# Altium schematic sheet BMS schematic.schdoc
size 310 x 208 mm
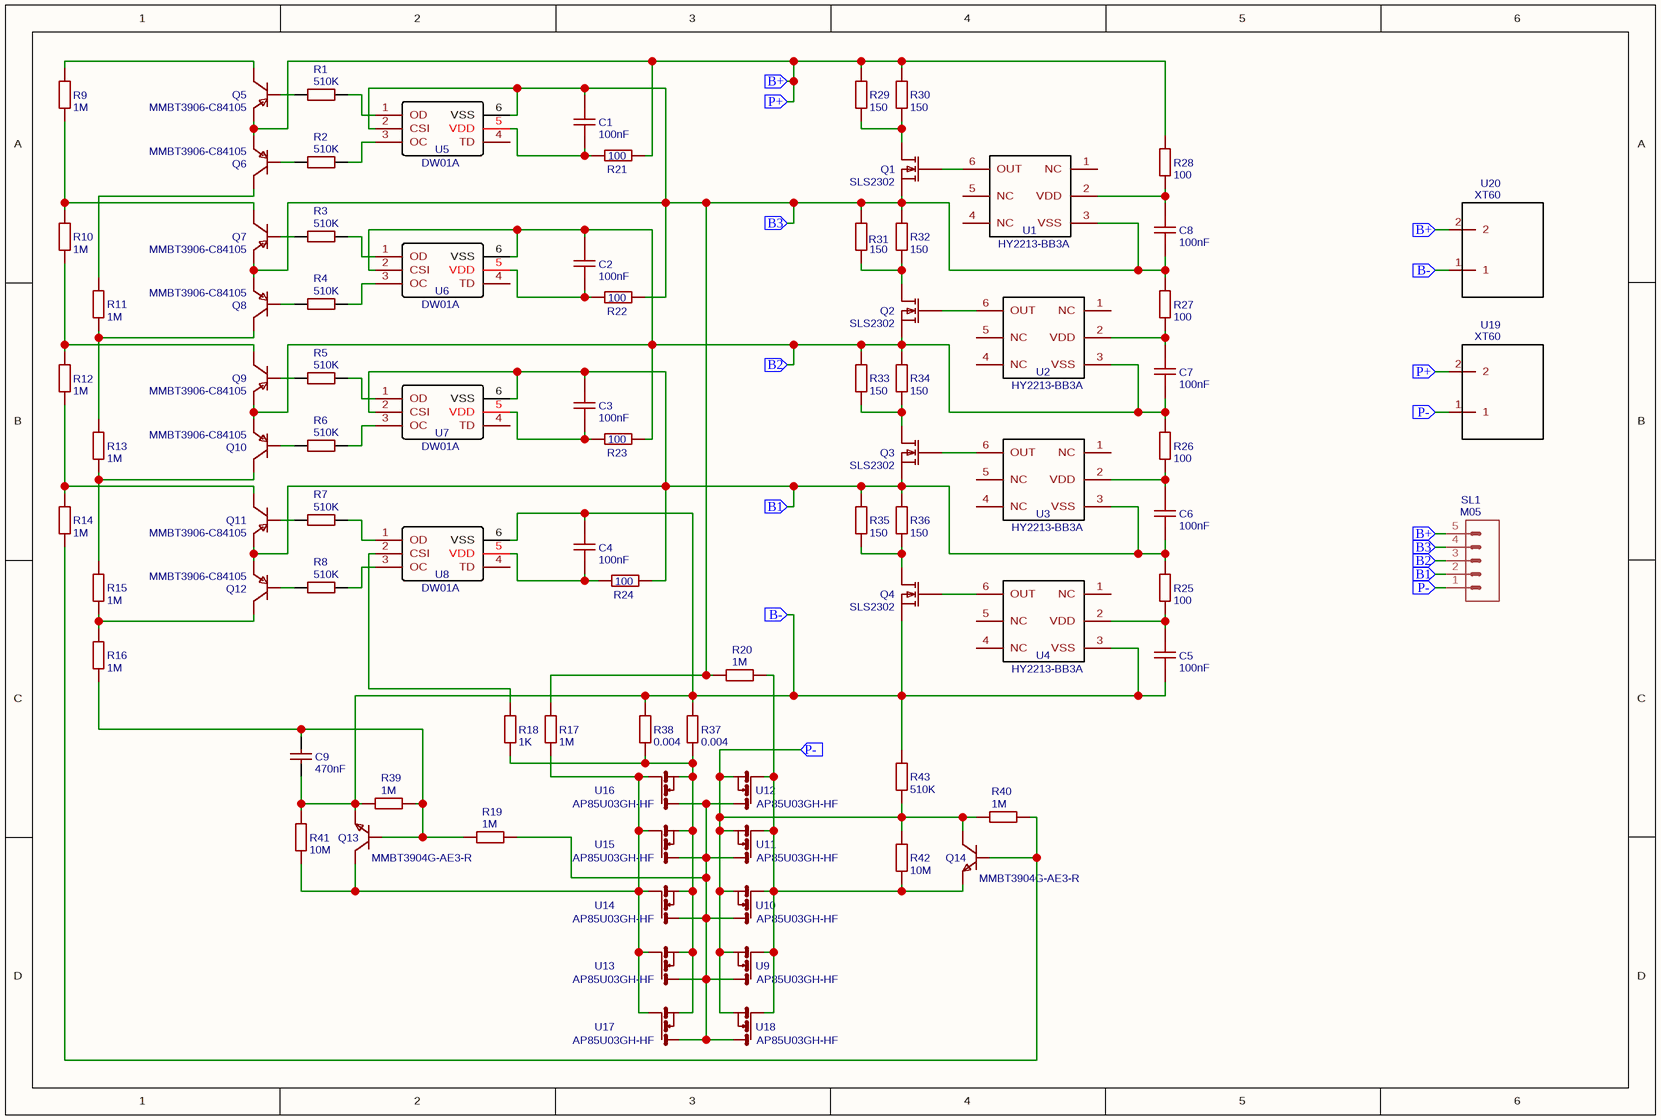
[diagram p0: BMS schematic.schdoc]

## Parts
C1  100nF  [C0805]
C2  100nF  [C0805]
C3  100nF  [C0805]
C4  100nF  [C0805]
C5  100nF  [C0805]
C6  100nF  [C0805]
C7  100nF  [C0805]
C8  100nF  [C0805]
C9  470nF  [C0805]
Q1  SLS2302  [SOT-23-3]
Q2  SLS2302  [SOT-23-3]
Q3  SLS2302  [SOT-23-3]
Q4  SLS2302  [SOT-23-3]
Q5  MMBT3906-C84105  [SOT-23-3_L2.9-W1.3-P1.90-LS2.4-BR]
Q6  MMBT3906-C84105  [SOT-23-3_L2.9-W1.3-P1.90-LS2.4-BR]
Q7  MMBT3906-C84105  [SOT-23-3_L2.9-W1.3-P1.90-LS2.4-BR]
Q8  MMBT3906-C84105  [SOT-23-3_L2.9-W1.3-P1.90-LS2.4-BR]
Q9  MMBT3906-C84105  [SOT-23-3_L2.9-W1.3-P1.90-LS2.4-BR]
Q10  MMBT3906-C84105  [SOT-23-3_L2.9-W1.3-P1.90-LS2.4-BR]
Q11  MMBT3906-C84105  [SOT-23-3_L2.9-W1.3-P1.90-LS2.4-BR]
Q12  MMBT3906-C84105  [SOT-23-3_L2.9-W1.3-P1.90-LS2.4-BR]
Q13  MMBT3904G-AE3-R  [SOT-23-3_L2.9-W1.6-P1.90-LS2.8-TR-CW]
Q14  MMBT3904G-AE3-R  [SOT-23-3_L2.9-W1.6-P1.90-LS2.8-TR-CW]
R1  510K  [R0805]
R2  510K  [R0805]
R3  510K  [R0805]
R4  510K  [R0805]
R5  510K  [R0805]
R6  510K  [R0805]
R7  510K  [R0805]
R8  510K  [R0805]
R9  1M  [R0805]
R10  1M  [R0805]
R11  1M  [R0805]
R12  1M  [R0805]
R13  1M  [R0805]
R14  1M  [R0805]
R15  1M  [R0805]
R16  1M  [R0805]
R17  1M  [R0805]
R18  1K  [R0805]
R19  1M  [R0805]
R20  1M  [R0805]
R21  100  [R0805]
R22  100  [R0805]
R23  100  [R0805]
R24  100  [R0805]
R25  100  [R0805]
R26  100  [R0805]
R27  100  [R0805]
R28  100  [R0805]
R29  150  [R0805]
R30  150  [R0805]
R31  150  [R0805]
R32  150  [R0805]
R33  150  [R0805]
R34  150  [R0805]
R35  150  [R0805]
R36  150  [R0805]
R37  0.004  [R2512]
R38  0.004  [R2512]
R39  1M  [R0805]
R40  1M  [R0805]
R41  10M  [R0805]
R42  10M  [R0805]
R43  510K  [R0805]
SL1  M05  [05P]
U1  HY2213-BB3A  [SOT-23-6_L2.9-W1.6-P0.95-LS2.8-BR]
U2  HY2213-BB3A  [SOT-23-6_L2.9-W1.6-P0.95-LS2.8-BR]
U3  HY2213-BB3A  [SOT-23-6_L2.9-W1.6-P0.95-LS2.8-BR]
U4  HY2213-BB3A  [SOT-23-6_L2.9-W1.6-P0.95-LS2.8-BR]
U5  DW01A  [SOT-23-6_L2.9-W1.6-P0.95-LS2.8-BL]
U6  DW01A  [SOT-23-6_L2.9-W1.6-P0.95-LS2.8-BL]
U7  DW01A  [SOT-23-6_L2.9-W1.6-P0.95-LS2.8-BL]
U8  DW01A  [SOT-23-6_L2.9-W1.6-P0.95-LS2.8-BL]
U9  AP85U03GH-HF  [TO-252-3_L6.5-W5.8-P4.58-BR]
U10  AP85U03GH-HF  [TO-252-3_L6.5-W5.8-P4.58-BR]
U11  AP85U03GH-HF  [TO-252-3_L6.5-W5.8-P4.58-BR]
U12  AP85U03GH-HF  [TO-252-3_L6.5-W5.8-P4.58-BR]
U13  AP85U03GH-HF  [TO-252-3_L6.5-W5.8-P4.58-BR]
U14  AP85U03GH-HF  [TO-252-3_L6.5-W5.8-P4.58-BR]
U15  AP85U03GH-HF  [TO-252-3_L6.5-W5.8-P4.58-BR]
U16  AP85U03GH-HF  [TO-252-3_L6.5-W5.8-P4.58-BR]
U17  AP85U03GH-HF  [TO-252-3_L6.5-W5.8-P4.58-BR]
U18  AP85U03GH-HF  [TO-252-3_L6.5-W5.8-P4.58-BR]
U19  XT60  [XT60]
U20  XT60  [XT60]

## Ports
B1 (in), B2 (in), B3 (in), B+ (in), B- (in), P+ (in), P- (in)

## Nets
B1: C3.2 C6.1 Q3.2(S) Q11.2(E) Q12.2(E) R24.2 R25.2 R35.2 R36.2 SL1.2 U3.3(VSS) U7.2(CSI) U7.6(VSS) ; port B1
B2: C2.2 C7.1 Q2.2(S) Q9.2(E) Q10.2(E) R23.2 R26.2 R33.2 R34.2 SL1.3 U2.3(VSS) U6.2(CSI) U6.6(VSS) ; port B2
B3: C1.2 C8.1 Q1.2(S) Q7.2(E) Q8.2(E) R17.2 R20.2 R22.2 R27.2 R31.2 R32.2 SL1.4 U1.3(VSS) U5.2(CSI) U5.6(VSS) ; port B3
B+: Q5.2(E) Q6.2(E) R21.2 R28.2 R29.2 R30.2 SL1.5 U19.2 U20.2 ; port B+, port P+
B-: C4.2 C5.1 C9.2 Q4.2(S) Q13.1(E) R37.2 R38.2 R39.2 R41.2 R43.2 U4.3(VSS) U8.6(VSS) U20.1 ; port B-
P-: Q14.3(C) R40.1 R42.2 R43.1 SL1.1 U9.3(S) U10.3(S) U11.3(S) U12.3(S) U18.3(S) U19.1 ; port P-
NetC1_1: C1.1 R21.1 U5.5(VDD)
NetC2_1: C2.1 R22.1 U6.5(VDD)
NetC3_1: C3.1 R23.1 U7.5(VDD)
NetC4_1: C4.1 R24.1 U8.5(VDD)
NetC5_2: C5.2 R25.1 U4.2(VDD)
NetC6_2: C6.2 R26.1 U3.2(VDD)
NetC7_2: C7.2 R27.1 U2.2(VDD)
NetC8_2: C8.2 R28.1 U1.2(VDD)
NetC9_1: C9.1 Q13.2(B) R16.1 R19.2 R39.1
NetQ1_1: Q1.1(G) U1.6(OUT)
NetQ1_3: Q1.3(D) R29.1 R30.1
NetQ2_1: Q2.1(G) U2.6(OUT)
NetQ2_3: Q2.3(D) R31.1 R32.1
NetQ3_1: Q3.1(G) U3.6(OUT)
NetQ3_3: Q3.3(D) R33.1 R34.1
NetQ4_1: Q4.1(G) U4.6(OUT)
NetQ4_3: Q4.3(D) R35.1 R36.1
NetQ5_1: Q5.1(B) R1.1
NetQ5_3: Q5.3(C) R9.2
NetQ6_1: Q6.1(B) R2.1
NetQ6_3: Q6.3(C) R11.2
NetQ7_1: Q7.1(B) R3.1
NetQ7_3: Q7.3(C) R9.1 R10.2
NetQ8_1: Q8.1(B) R4.1
NetQ8_3: Q8.3(C) R11.1 R13.2
NetQ9_1: Q9.1(B) R5.1
NetQ9_3: Q9.3(C) R10.1 R12.2
NetQ10_1: Q10.1(B) R6.1
NetQ10_3: Q10.3(C) R13.1 R15.2
NetQ11_1: Q11.1(B) R7.1
NetQ11_3: Q11.3(C) R12.1 R14.2
NetQ12_1: Q12.1(B) R8.1
NetQ12_3: Q12.3(C) R15.1 R16.2
NetQ13_3: Q13.3(C) R17.1 R41.1 U13.1(G) U14.1(G) U15.1(G) U16.1(G) U17.1(G)
NetQ14_1: Q14.1(E) R20.1 R42.1 U9.1(G) U10.1(G) U11.1(G) U12.1(G) U18.1(G)
NetQ14_2: Q14.2(B) R14.1 R40.2
NetR1_2: R1.2 U5.1(OD)
NetR2_2: R2.2 U5.3(OC)
NetR3_2: R3.2 U6.1(OD)
NetR4_2: R4.2 U6.3(OC)
NetR5_2: R5.2 U7.1(OD)
NetR6_2: R6.2 U7.3(OC)
NetR7_2: R7.2 U8.1(OD)
NetR8_2: R8.2 U8.3(OC)
NetR18_1: R18.1 R37.1 R38.1 U13.3(S) U14.3(S) U15.3(S) U16.3(S) U17.3(S)
NetR18_2: R18.2 U8.2(CSI)
NetR19_1: R19.1 U9.2(D) U10.2(D) U11.2(D) U12.2(D) U13.2(D) U14.2(D) U15.2(D) U16.2(D) U17.2(D) U18.2(D)

Not connected (* = marked no-connect by the designer): U1 1(NC) 4(NC) 5(NC); U2 1(NC) 4(NC) 5(NC); U3 1(NC) 4(NC) 5(NC); U4 1(NC) 4(NC) 5(NC); U5 4(TD); U6 4(TD); U7 4(TD); U8 4(TD)

## Library data of the parts
C1-C8 = 100nF: BOM_Manufacturer: IHHEC(HOLY STONE ENTERPRISE CO., LTD); BOM_Manufacturer Part: C0805X104K101TB; nameAlias: Capacitance; Contributor: LCSC; BOM_Supplier: LCSC; BOM_Supplier Part: C495959; spicePre: C; spiceSymbolName: C0805X104K101TB
C9 = 470nF: BOM_Manufacturer Part: CL21B474KBFNNNE; BOM_Manufacturer: SAMSUNG; nameAlias: Capacitance; SMT Type: Basic; BOM_Supplier: LCSC; BOM_LCSC Assembly: Yes; BOM_Supplier Part: C13967; spicePre: C; spiceSymbolName: CL21B474KBFNNNE
Q1-Q4 = SLS2302: BOM_Manufacturer: SLKORMICRO Elec.; Contributor: saidbek; BOM_Supplier: LCSC; BOM_Supplier Part: C251150; BOM_Manufacturer Part: SLS2302; spicePre: Q; spiceSymbolName: SLS2302
Q5-Q12 = MMBT3906-C84105: BOM_Manufacturer: SEMTECH; SMT Type: Extend; Contributor: 立创EDA官方封装库; BOM_Supplier: LCSC; BOM_Manufacturer Part: MMBT3906; BOM_Supplier Part: C84105; BOM_LCSC Assembly: Yes; spicePre: Q; spiceSymbolName: MMBT3906-C84105
Q13 Q14 = MMBT3904G-AE3-R: BOM_Manufacturer: SEMTECH; SMT Type: Extend; BOM_Supplier: LCSC; BOM_Manufacturer Part: MMBT3904; BOM_Supplier Part: C84104; BOM_LCSC Assembly: Yes; spicePre: Q; spiceSymbolName: MMBT3904G-AE3-R
R1-R8 = 510K: BOM_Manufacturer: YAGEO; BOM_Manufacturer Part: RC0805JR-07510KL; nameAlias: Resistance (Ohms); BOM_Supplier: LCSC; BOM_Supplier Part: C137422; spicePre: R; spiceSymbolName: RC0805JR-07510KL
R9-R17 R19 R20 R39 R40 = 1M: BOM_Manufacturer: Tyohm; BOM_Manufacturer Part: RMC08051M1%N; nameAlias: Resistance (Ohms); Contributor: LCSC; BOM_Supplier: LCSC; BOM_Supplier Part: C325768; spicePre: R; spiceSymbolName: RMC08051M1%N
R18 = 1K: BOM_Manufacturer: KOA Speer Elec; BOM_Manufacturer Part: RN73H2ATTD1001B25; nameAlias: Resistance (Ohms); Contributor: LCSC; BOM_Supplier: LCSC; BOM_Supplier Part: C186253; spicePre: R; spiceSymbolName: RN73H2ATTD1001B25
R21-R28 = 100: BOM_Manufacturer: YAGEO; BOM_Manufacturer Part: AC0805JR-07100RL; nameAlias: Resistance (Ohms); Contributor: LCSC; BOM_Supplier: LCSC; BOM_Supplier Part: C144538; spicePre: R; spiceSymbolName: AC0805JR-07100RL
R29-R36 = 150: BOM_Manufacturer: Stackpole Elec; BOM_Manufacturer Part: RMCF0805JT150R; nameAlias: Resistance (Ohms); Contributor: LCSC; BOM_Supplier: LCSC; BOM_Supplier Part: C237796; spicePre: R; spiceSymbolName: RMCF0805JT150R
R37 R38 = 0.004: BOM_Manufacturer: SUP; BOM_Manufacturer Part: MRF6432(2512)LR004FTS; nameAlias: Resistance (Ohms); Contributor: LCSC; BOM_Supplier: LCSC; BOM_Supplier Part: C76237; spicePre: R; spiceSymbolName: RLP25JEGR004
R41 R42 = 10M: BOM_Manufacturer: Tyohm; BOM_Manufacturer Part: RMC080510M1%N; nameAlias: Resistance (Ohms); Contributor: LCSC; BOM_Supplier: LCSC; BOM_Supplier Part: C325949; spicePre: R; spiceSymbolName: RMC080510M1%N
R43 = 510K: BOM_Manufacturer: Ever Ohms Tech; BOM_Manufacturer Part: CR0805F510KP05; nameAlias: Resistance (Ohms); Contributor: LCSC; BOM_Supplier: LCSC; BOM_Supplier Part: C245345; spicePre: R; spiceSymbolName: CR0805F510KP05
SL1 = M05: Contributor: sebby; spicePre: S; spiceSymbolName: M05
U1-U4 = HY2213-BB3A: BOM_Manufacturer: HYCON; SMT Type: Extend; BOM_Supplier: LCSC; BOM_Manufacturer Part: HY2213-BB3A; BOM_Supplier Part: C113632; BOM_LCSC Assembly: Yes; spicePre: U; spiceSymbolName: HY2213-BB3A
U5-U8 = DW01A: BOM_Manufacturer: FM; SMT Type: Extend; BOM_Supplier: LCSC; BOM_Manufacturer Part: DW01A; BOM_Supplier Part: C85680; BOM_LCSC Assembly: Yes; spicePre: U; spiceSymbolName: DW01A
U9-U18 = AP85U03GH-HF: BOM_Manufacturer: Wuxi NCE Power Semiconductor; BOM_Manufacturer Part: NCE3080K; Contributor: Jesseprominer; BOM_Supplier Part: C108901; spicePre: U; spiceSymbolName: P75N02LD
U19 U20 = XT60: Contributor: Drone_H2EA; BOM_Manufacturer Part: ?; spicePre: U